# Altium project DCM_Flyback.PrjPcb
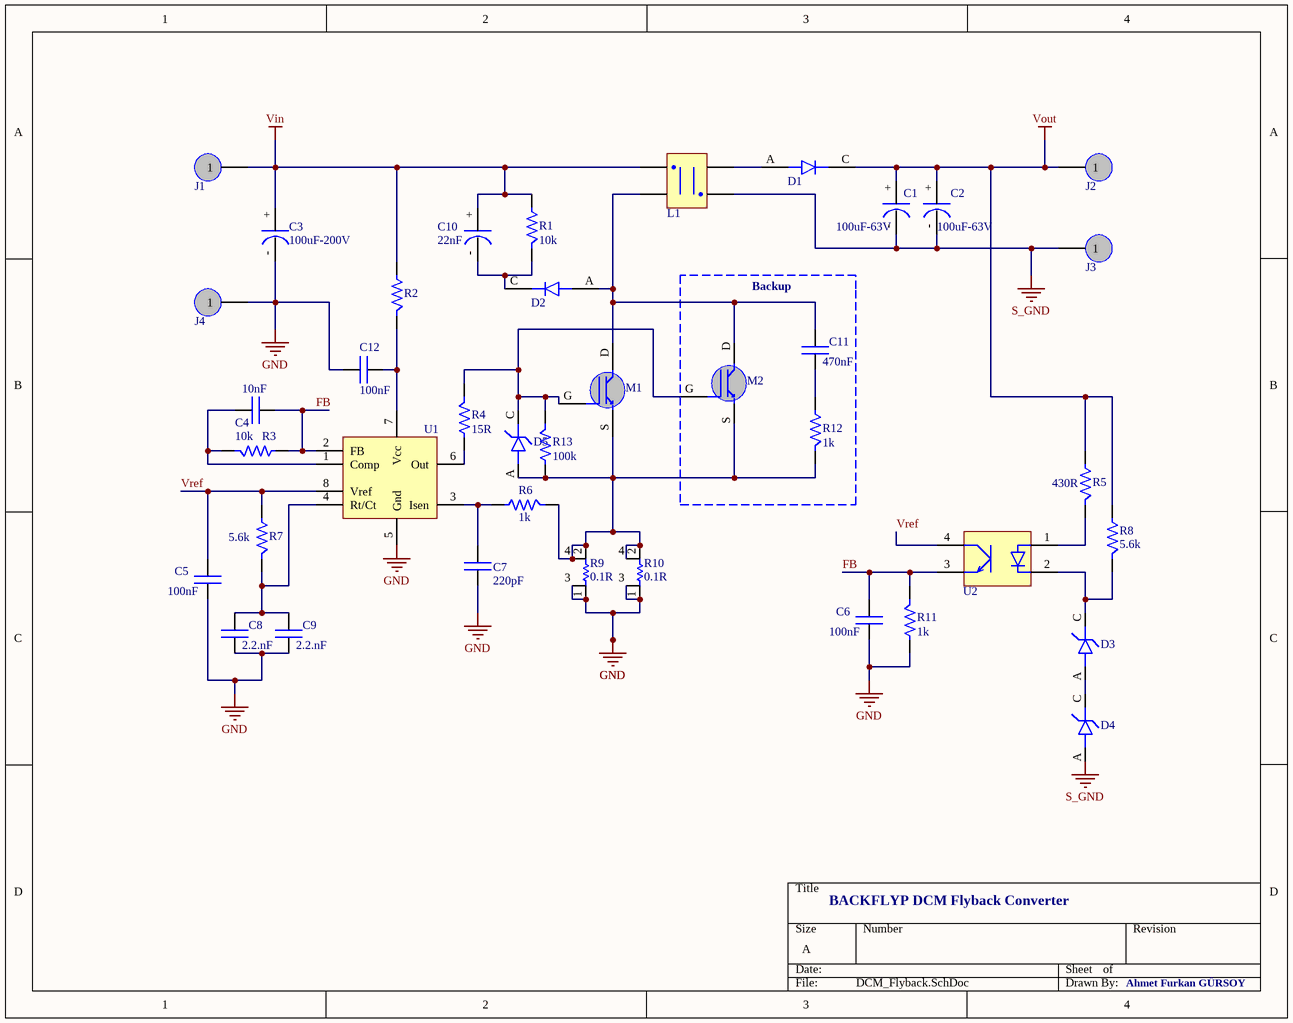
[diagram p0: DCM_Flyback.SchDoc]
1 sheet, 39 parts. Net scope: global (net labels, ports and power ports of the same name join across sheets).
Board file: DCM_Flyback.PcbDoc

## Sheet DCM_Flyback.SchDoc
size A

### Parts
C1  100uF-63V  [100uF-63V]
C2  100uF-63V  [100uF-63V]
C3  100uF-200V  [100uF-63V]
C4  10nF  [Cap-lentil-100n]
C5  100nF  [Cap-lentil-100n]
C6  100nF  [Cap-lentil-100n]
C7  220pF  [Cap-lentil-2.2n]
C8  2.2.nF  [Cap-lentil-2.2n]
C9  2.2.nF  [Cap-lentil-2.2n]
C10  22nF  [20uF-50V]
C11  470nF  [Cap-lentil-100n]
C12  100nF  [Cap-lentil-2.2n]
D1  Secondary Diode  [MBR10150]  (value not drawn)
D2  Snubber Diode  [MBR10150]  (value not drawn)
D3  Zener  [Zener]  (value not drawn)
D4  Zener  [Zener]  (value not drawn)
D5  Zener  [Zener]  (value not drawn)
J1  4mm Con  [Con-4mm]  (value not drawn)
J2  4mm Con  [Con-4mm]  (value not drawn)
J3  4mm Con  [Con-4mm]  (value not drawn)
J4  4mm Con  [Con-4mm]  (value not drawn)
L1  Transformer  [Transformer_EE3515]  (value not drawn)
M1  MOSFET  [MOSFET]  (value not drawn)
M2  IRFP250N  [TO247 with Heatsink]  (value not drawn)
R1  10k  [StoneRes-5W]
R2  IncRes  [IncRes]  (value not drawn)
R3  10k  [IncRes]
R4  15R  [IncRes]
R5  430R  [Resistor]
R6  1k  [IncRes]
R7  5.6k  [IncRes]
R8  5.6k  [Resistor]
R9  0.1R  [ISB_SMT_V1_E]
R10  0.1R  [ISB_SMT_V1_E]
R11  1k  [IncRes]
R12  1k  [IncRes]
R13  100k  [IncRes]
U1  UC3843AD  [UC3843AD]  (value not drawn)
U2  Opto  [Opto]  (value not drawn)

### Blocks framed on the sheet
Backup: C11 M2 R12

### Nets
GND: C3.- C5.2 C6.2 C7.2 C8.2 C9.2 C12.1 J4.1 R9.1 R9.3 R10.1 R10.3 R11.1 U1.5(Gnd)
S_GND: C1.- C2.- D4.A J3.1 L1.4
Vin: C3.+ C10.+ J1.1 L1.1 R1.1 R2.1
Vout: C1.+ C2.+ D1.C J2.1 R5.1 R8.1
FB: C4.2 C6.1 R3.1 R11.2 U1.2(FB) U2.3(E)
Vref: C5.1 R7.1 U1.8(Vref) U2.4(Col)
NetC4_1: C4.1 R3.2 U1.1(Comp)
NetC7_1: C7.1 R6.1 U1.3(Isen)
NetC8_1: C8.1 C9.1 R7.2 U1.4(Rt/Ct)
NetC10_-: C10.- D2.C R1.2
NetC11_1: C11.1 D2.A L1.2 M1.D M2.D
NetC11_2: C11.2 R12.1
NetC12_2: C12.2 R2.2 U1.7(Vcc)
NetD1_A: D1.A L1.3
NetD3_A: D3.A D4.C
NetD3_C: D3.C R8.2 U2.2(C)
NetD5_A: D5.A M1.S M2.S R6.2 R9.2 R9.4 R10.2 R10.4 R12.2 R13.1
NetD5_C: D5.C M1.G M2.G R4.2 R13.2
NetR4_1: R4.1 U1.6(Out)
NetR5_2: R5.2 U2.1(A)

### Notes on the sheet
- BACKFLYP DCM Flyback Converter
- Ahmet Furkan GÜRSOY

### Library data of the parts
C3 = 100uF-63V
C4-C6 C11 = Capacitor_lentil_100n
C7-C9 C12 = Cap-Lentil-2.2n
C10 = 20uF-50V
R1 = StoneRes
R3 R4 R6 R7 R11-R13 = IncRes
R5 R8 = Resistor
R9 R10 = ISB_RES-SMT: RES SMD 2817 1% 5W C; Manufacturer: Isabellenhutte; SAPPartNumber: DSB; Checked/RevisedBy: CYEGIN; Value: DSB; Approved: EKARAGOZ; LatestRevisionDate: *; LatestRevisionNote: *; PackageDescription: DSB; PackageReference: SMT; Published: 26-10-2017; Publisher: PPOSPOS; Version: 1.0